# Altium schematic sheet CtDPS_Stage.SchDoc
size B; SheetNumber: 2; SheetTotal: 2
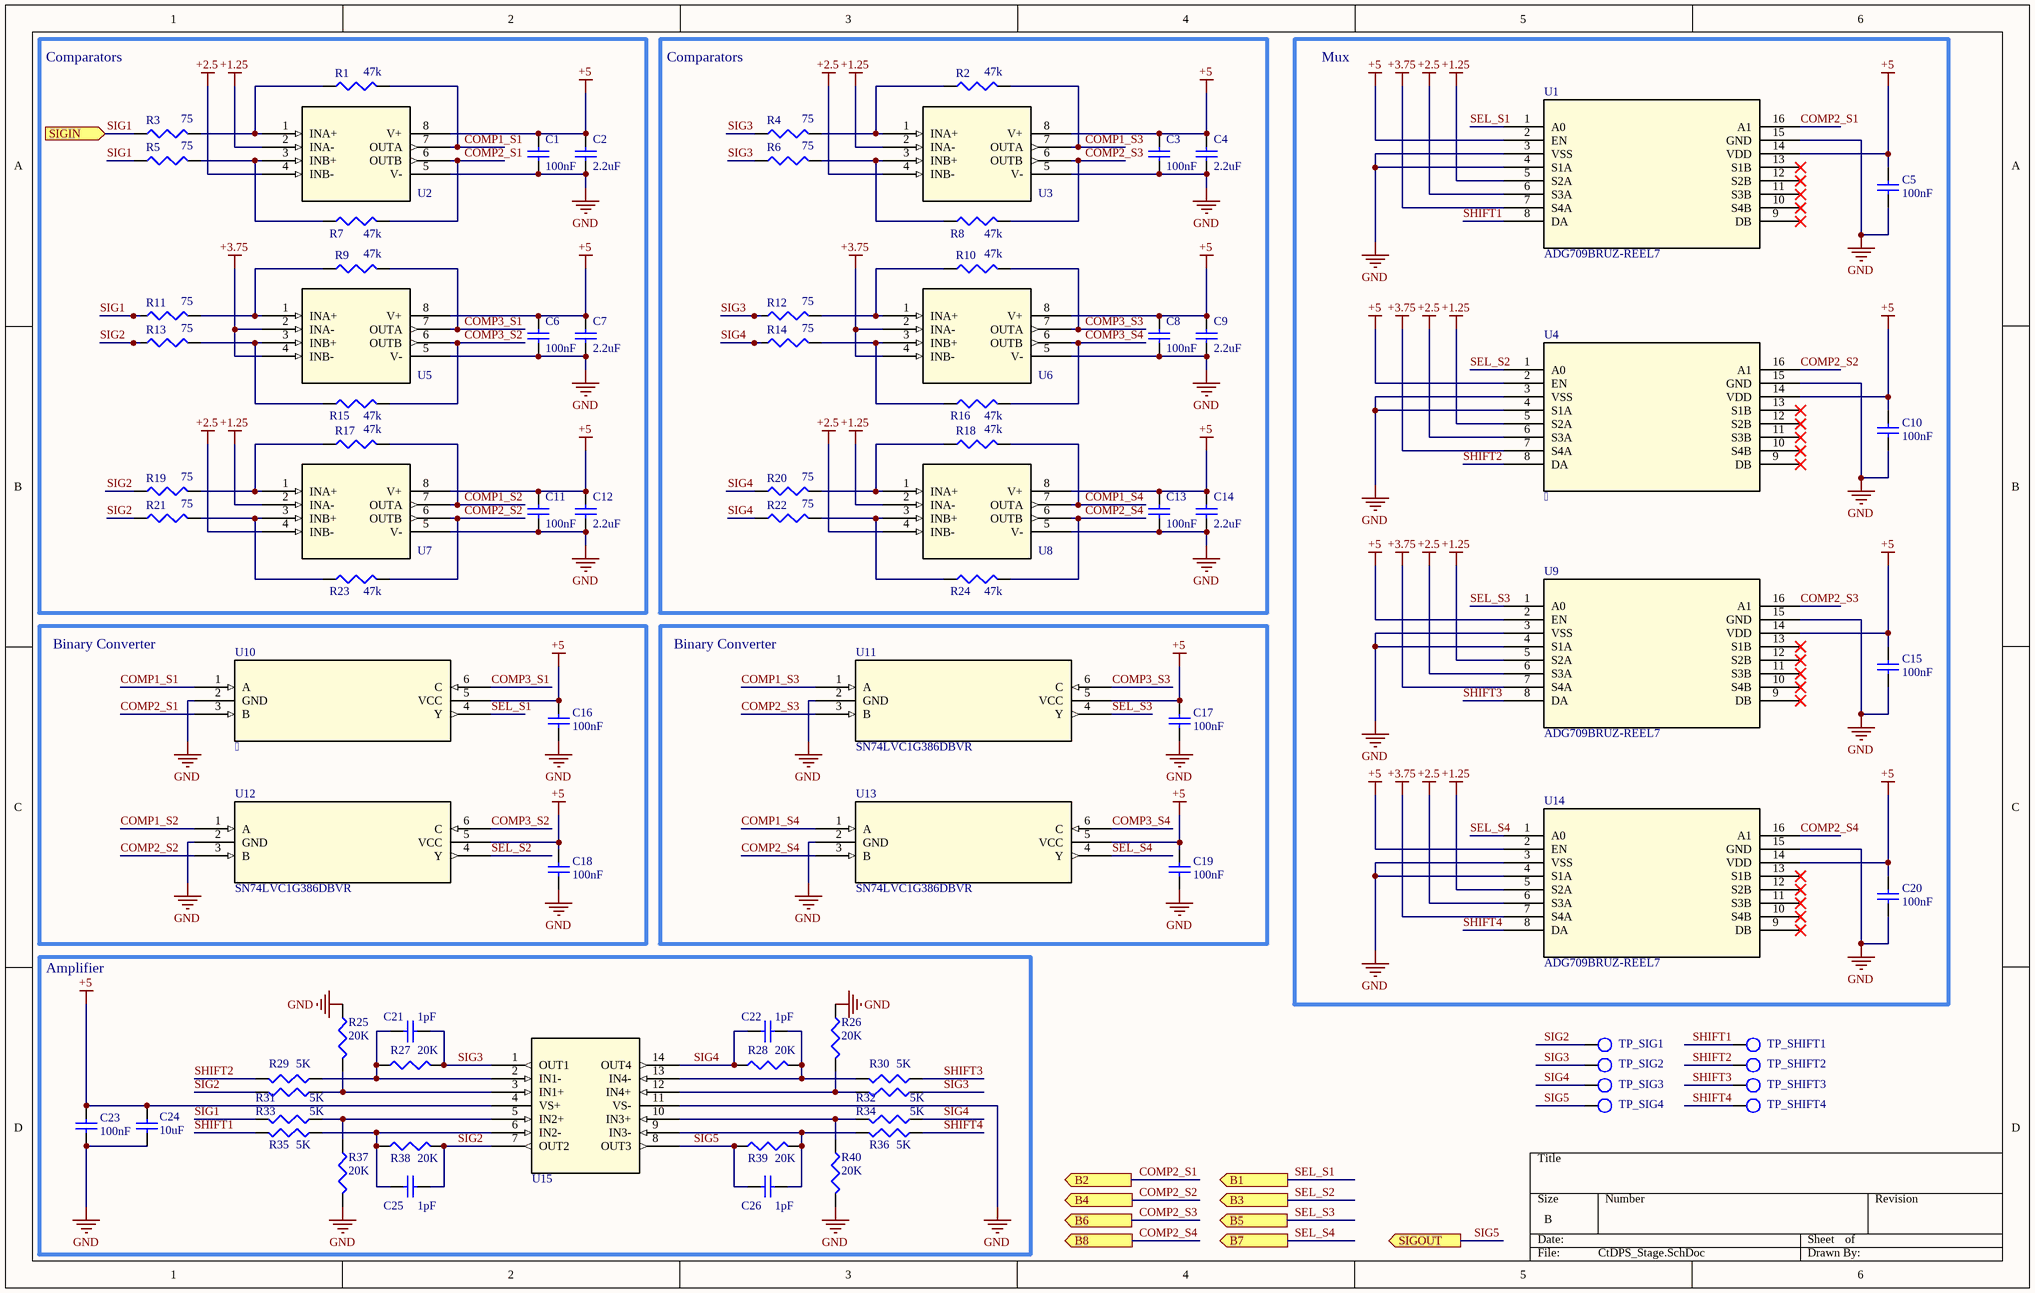
[diagram p0: CtDPS_Stage.SchDoc]

## Parts
C1  100nF  [C_0402]
C2  2.2uF  [C_0402]
C3  100nF  [C_0402]
C4  2.2uF  [C_0402]
C5  100nF  [C_0402]
C6  100nF  [C_0402]
C7  2.2uF  [C_0402]
C8  100nF  [C_0402]
C9  2.2uF  [C_0402]
C10  100nF  [C_0402]
C11  100nF  [C_0402]
C12  2.2uF  [C_0402]
C13  100nF  [C_0402]
C14  2.2uF  [C_0402]
C15  100nF  [C_0402]
C16  100nF  [C_0402]
C17  100nF  [C_0402]
C18  100nF  [C_0402]
C19  100nF  [C_0402]
C20  100nF  [C_0402]
C21  1pF  [C_0402]
C22  1pF  [C_0402]
C23  100nF  [C_0402]
C24  10uF  [C_0402]
C25  1pF  [C_0402]
C26  1pF  [C_0402]
R1  47k  [RES_0603]
R2  47k  [RES_0603]
R3  75  [RES_0603]
R4  75  [RES_0603]
R5  75  [RES_0603]
R6  75  [RES_0603]
R7  47k  [RES_0603]
R8  47k  [RES_0603]
R9  47k  [RES_0603]
R10  47k  [RES_0603]
R11  75  [RES_0603]
R12  75  [RES_0603]
R13  75  [RES_0603]
R14  75  [RES_0603]
R15  47k  [RES_0603]
R16  47k  [RES_0603]
R17  47k  [RES_0603]
R18  47k  [RES_0603]
R19  75  [RES_0603]
R20  75  [RES_0603]
R21  75  [RES_0603]
R22  75  [RES_0603]
R23  47k  [RES_0603]
R24  47k  [RES_0603]
R25  20K  [RES_0402]
R26  20K  [RES_0402]
R27  20K  [RES_0402]
R28  20K  [RES_0402]
R29  5K  [RES_0402]
R30  5K  [RES_0402]
R31  5K  [RES_0402]
R32  5K  [RES_0402]
R33  5K  [RES_0402]
R34  5K  [RES_0402]
R35  5K  [RES_0402]
R36  5K  [RES_0402]
R37  20K  [RES_0402]
R38  20K  [RES_0402]
R39  20K  [RES_0402]
R40  20K  [RES_0402]
TP_SHIFT1  TESTPOINT  [TESTPOINT]  (value not drawn)
TP_SHIFT2  TESTPOINT  [TESTPOINT]  (value not drawn)
TP_SHIFT3  TESTPOINT  [TESTPOINT]  (value not drawn)
TP_SHIFT4  TESTPOINT  [TESTPOINT]  (value not drawn)
TP_SIG1  TESTPOINT  [TESTPOINT]  (value not drawn)
TP_SIG2  TESTPOINT  [TESTPOINT]  (value not drawn)
TP_SIG3  TESTPOINT  [TESTPOINT]  (value not drawn)
TP_SIG4  TESTPOINT  [TESTPOINT]  (value not drawn)
U1  ADG709BRUZ-REEL7  [ADG709BRUZ-REEL7]
U2  TLV3502AIDR  [TLV3502AIDR]  (value not drawn)
U3  TLV3502AIDR  [TLV3502AIDR]  (value not drawn)
U4    [ADG709BRUZ-REEL7]
U5  TLV3502AIDR  [TLV3502AIDR]  (value not drawn)
U6  TLV3502AIDR  [TLV3502AIDR]  (value not drawn)
U7  TLV3502AIDR  [TLV3502AIDR]  (value not drawn)
U8  TLV3502AIDR  [TLV3502AIDR]  (value not drawn)
U9  ADG709BRUZ-REEL7  [ADG709BRUZ-REEL7]
U10    [SN74LVC1G386DBVR]
U11  SN74LVC1G386DBVR  [SN74LVC1G386DBVR]
U12  SN74LVC1G386DBVR  [SN74LVC1G386DBVR]
U13  SN74LVC1G386DBVR  [SN74LVC1G386DBVR]
U14  ADG709BRUZ-REEL7  [ADG709BRUZ-REEL7]
U15  ADA4891-4ARZ-R7  [ADA4891-4ARZ-R7]  (value not drawn)

## Blocks framed on the sheet
Comparators: C1 C2 C6 C7 C11 C12 R1 R3 R5 R7 R9 R11 R13 R15 R17 R19 R21 R23 U2 U5 U7
Comparators: C3 C4 C8 C9 C13 C14 R2 R4 R6 R8 R10 R12 R14 R16 R18 R20 R22 R24 U3 U6 U8
Mux: C5 C10 C15 C20 U1 U4 U9 U14
Binary Converter: C16 C18 U10 U12
Binary Converter: C17 C19 U11 U13
Amplifier: C21-C26 R25-R40 U15

## Ports
B1 (out), B2 (out), B3 (out), B4 (out), B5 (out), B6 (out), B7 (out), B8 (out), SIGIN (in), SIGOUT (out)

## Nets
+1.25: U1.5(S2A) U2.2(INA-) U3.2(INA-) U4.5(S2A) U7.2(INA-) U8.2(INA-) U9.5(S2A) U14.5(S2A)
+2.5: U1.6(S3A) U2.4(INB-) U3.4(INB-) U4.6(S3A) U7.4(INB-) U8.4(INB-) U9.6(S3A) U14.6(S3A)
+3.75: U1.7(S4A) U4.7(S4A) U5.2(INA-) U5.4(INB-) U6.2(INA-) U6.4(INB-) U9.7(S4A) U14.7(S4A)
+5: C1.1 C2.2 C3.1 C4.2 C5.1 C6.1 C7.2 C8.1 C9.2 C10.1 C11.1 C12.2 C13.1 C14.2 C15.1 C16.1 C17.1 C18.1 C19.1 C20.1 C23.1 C24.2 U1.2(EN) U1.14(VDD) U2.8(V+) U3.8(V+) U4.2(EN) U4.14(VDD) U5.8(V+) U6.8(V+) U7.8(V+) U8.8(V+) U9.2(EN) U9.14(VDD) U10.5(VCC) U11.5(VCC) U12.5(VCC) U13.5(VCC) U14.2(EN) U14.14(VDD) U15.4(VS+)
GND: C1.2 C2.1 C3.2 C4.1 C5.2 C6.2 C7.1 C8.2 C9.1 C10.2 C11.2 C12.1 C13.2 C14.1 C15.2 C16.2 C17.2 C18.2 C19.2 C20.2 C23.2 C24.1 R25.1 R26.1 R37.2 R40.2 U1.3(VSS) U1.4(S1A) U1.15(GND) U2.5(V-) U3.5(V-) U4.3(VSS) U4.4(S1A) U4.15(GND) U5.5(V-) U6.5(V-) U7.5(V-) U8.5(V-) U9.3(VSS) U9.4(S1A) U9.15(GND) U10.2(GND) U11.2(GND) U12.2(GND) U13.2(GND) U14.3(VSS) U14.4(S1A) U14.15(GND) U15.11(VS-)
COMP1_S1: R1.2 U2.7(OUTA) U10.1(A)
COMP1_S2: R17.2 U7.7(OUTA) U12.1(A)
COMP1_S3: R2.2 U3.7(OUTA) U11.1(A)
COMP1_S4: R18.2 U8.7(OUTA) U13.1(A)
COMP2_S1: R7.2 U1.16(A1) U2.6(OUTB) U10.3(B) ; port B2
COMP2_S2: R23.2 U4.16(A1) U7.6(OUTB) U12.3(B) ; port B4
COMP2_S3: R8.2 U3.6(OUTB) U9.16(A1) U11.3(B) ; port B6
COMP2_S4: R24.2 U8.6(OUTB) U13.3(B) U14.16(A1) ; port B8
COMP3_S1: R9.2 U5.7(OUTA) U10.6(C)
COMP3_S2: R15.2 U5.6(OUTB) U12.6(C)
COMP3_S3: R10.2 U6.7(OUTA) U11.6(C)
COMP3_S4: R16.2 U6.6(OUTB) U13.6(C)
SEL_S1: U1.1(A0) U10.4(Y) ; port B1
SEL_S2: U4.1(A0) U12.4(Y) ; port B3
SEL_S3: U9.1(A0) U11.4(Y) ; port B5
SEL_S4: U13.4(Y) U14.1(A0) ; port B7
SHIFT1: R35.1 TP_SHIFT1.1 U1.8(DA)
SHIFT2: R29.1 TP_SHIFT2.1 U4.8(DA)
SHIFT3: R30.2 TP_SHIFT3.1 U9.8(DA)
SHIFT4: R36.2 TP_SHIFT4.1 U14.8(DA)
SIG1: R3.1 R5.1 R11.1 R33.1 ; port SIGIN
SIG2: C25.2 R13.1 R19.1 R21.1 R31.1 R38.2 TP_SIG1.1 U15.7(OUT2)
SIG3: C21.2 R4.1 R6.1 R12.1 R27.2 R32.2 TP_SIG2.1 U15.1(OUT1)
SIG4: C22.1 R14.1 R20.1 R22.1 R28.1 R34.2 TP_SIG3.1 U15.14(OUT4)
SIG5: C26.1 R39.1 TP_SIG4.1 U15.8(OUT3) ; port SIGOUT
NetC21_1: C21.1 R27.1 R29.2 U15.2(IN1-)
NetC22_2: C22.2 R28.2 R30.1 U15.13(IN4-)
NetC25_1: C25.1 R35.2 R38.1 U15.6(IN2-)
NetC26_2: C26.2 R36.1 R39.2 U15.9(IN3-)
NetR1_1: R1.1 R3.2 U2.1(INA+)
NetR2_1: R2.1 R4.2 U3.1(INA+)
NetR5_2: R5.2 R7.1 U2.3(INB+)
NetR6_2: R6.2 R8.1 U3.3(INB+)
NetR9_1: R9.1 R11.2 U5.1(INA+)
NetR10_1: R10.1 R12.2 U6.1(INA+)
NetR13_2: R13.2 R15.1 U5.3(INB+)
NetR14_2: R14.2 R16.1 U6.3(INB+)
NetR17_1: R17.1 R19.2 U7.1(INA+)
NetR18_1: R18.1 R20.2 U8.1(INA+)
NetR21_2: R21.2 R23.1 U7.3(INB+)
NetR22_2: R22.2 R24.1 U8.3(INB+)
NetR25_2: R25.2 R31.2 U15.3(IN1+)
NetR26_2: R26.2 R32.1 U15.12(IN4+)
NetR33_2: R33.2 R37.1 U15.5(IN2+)
NetR34_1: R34.1 R40.1 U15.10(IN3+)

Not connected (* = marked no-connect by the designer): U1 9(DB)* 10(S4B)* 11(S3B)* 12(S2B)* 13(S1B)*; U4 9(DB)* 10(S4B)* 11(S3B)* 12(S2B)* 13(S1B)*; U9 9(DB)* 10(S4B)* 11(S3B)* 12(S2B)* 13(S1B)*; U14 9(DB)* 10(S4B)* 11(S3B)* 12(S2B)* 13(S1B)*

## Library data of the parts
C1-C26 = C_0402
  C1 C3 C5 C6 C8 C10 C11 C13 C15-C20 C23: LCSC Part #: C1525
  C2 C4 C7 C9 C12 C14: LCSC Part #: C12530
  C21 C22 C25 C26: LCSC Part #: C1550
  C24: LCSC Part #: C15525
R1-R24 = RES_0603
  R1 R2 R7-R10 R15-R18 R23 R24: LCSC Part #: C25819
  R3-R6 R11-R14 R19-R22: LCSC Part #: C4275
R25-R40 = RES_0402
  R25-R28 R37-R40: LCSC Part #: C25765
  R29-R36: LCSC Part #: C5948099
U1 U4 U9 U14 = ADG709BRUZ-REEL7: CMOS Low Voltage, 3 Î© 4-Channel Multiplexer; LCSC Part #: C206785
U2 U3 U5-U8 = TLV3502AIDR: Dual 4.5ns Push-pull Rail-to-Rail Input, Rail-to-Rail Output TTL Comparators; LCSC Part #: C131165
U10-U13 = SN74LVC1G386DBVR: Single 3-input, 1.65-V to 5.5-V XOR (exclusive OR) gate 6-SOT-23 -40 to 125; LCSC Part #: C2838503
U15 = ADA4891-4ARZ-R7: Quad Rail-to-Rail Op-Amp, 240 MHz, 170 V/µs, SOT-23-5; LCSC Part #: C654290